# Altium schematic sheet QCopterRC_USB_Sch.SchDoc
size A4
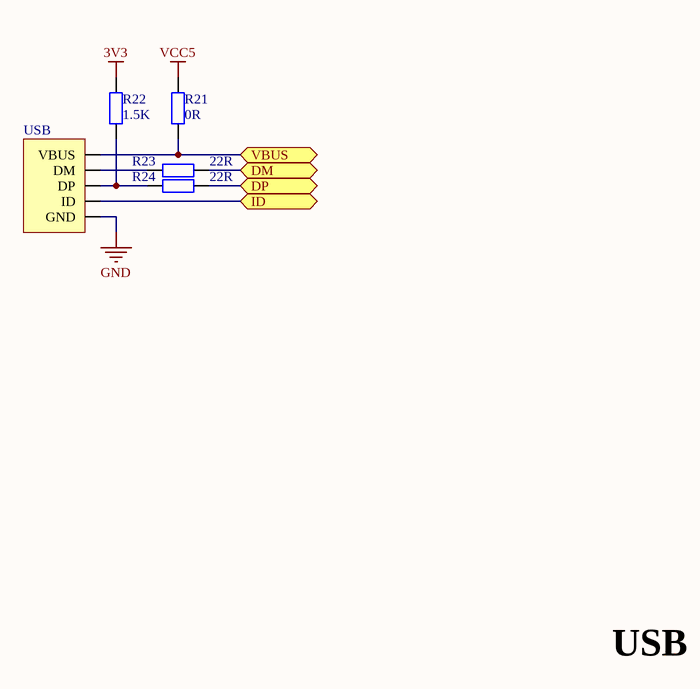
[diagram p0: QCopterRC_USB_Sch.SchDoc]

## Parts
R21  value 0R  [RES_0603]  (hidden comment: Res_0603)
R22  value 1.5K  [RES_0603]  (hidden comment: Res_0603)
R23  value 22R  [RES_0603]  (hidden comment: Res_0603)
R24  value 22R  [RES_0603]  (hidden comment: Res_0603)
USB  USB_Micro  [USB_MICRO_B]  (value not drawn)

## Ports
DM, DP, ID, VBUS

## Nets
3V3: R22.2
GND: USB.5(GND)
VCC5: R21.1
DM: R23.2 ; port DM
DP: R24.2 ; port DP
ID: USB.4(ID) ; port ID
VBUS: R21.2 USB.1(VBUS) ; port VBUS
NetR22_1: R22.1 R24.1 USB.3(DP)
NetR23_1: R23.1 USB.2(DM)

## Notes on the sheet
- USB

## Library data of the parts
R21-R24 = Res_0603: Resistor
USB = USB_Micro: USB